# Altium schematic sheet BSPD.SchDoc
size 528 x 268 mm; Origin: Eagle
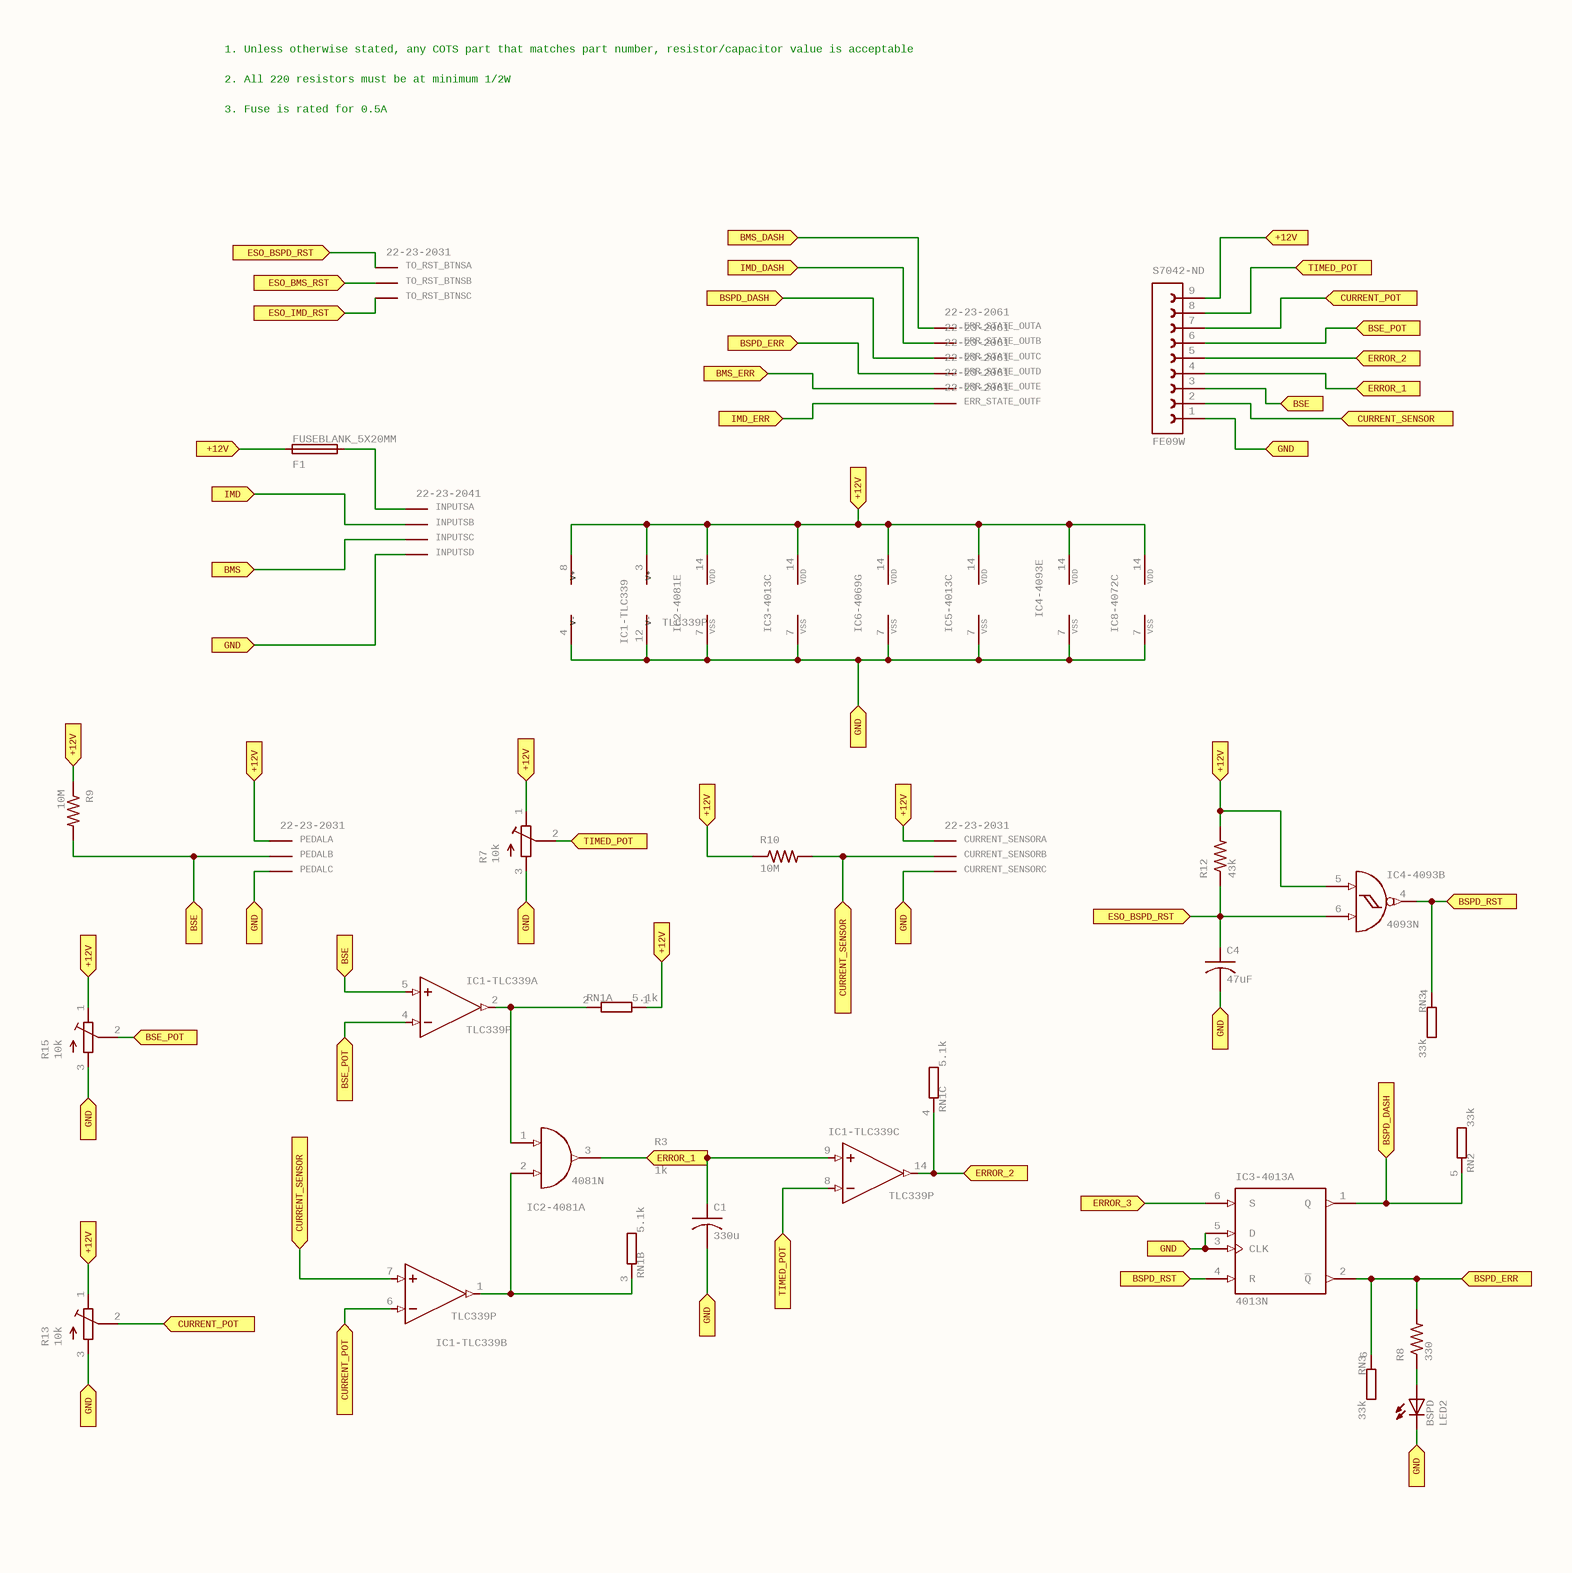
[diagram p0: BSPD.SchDoc, left]
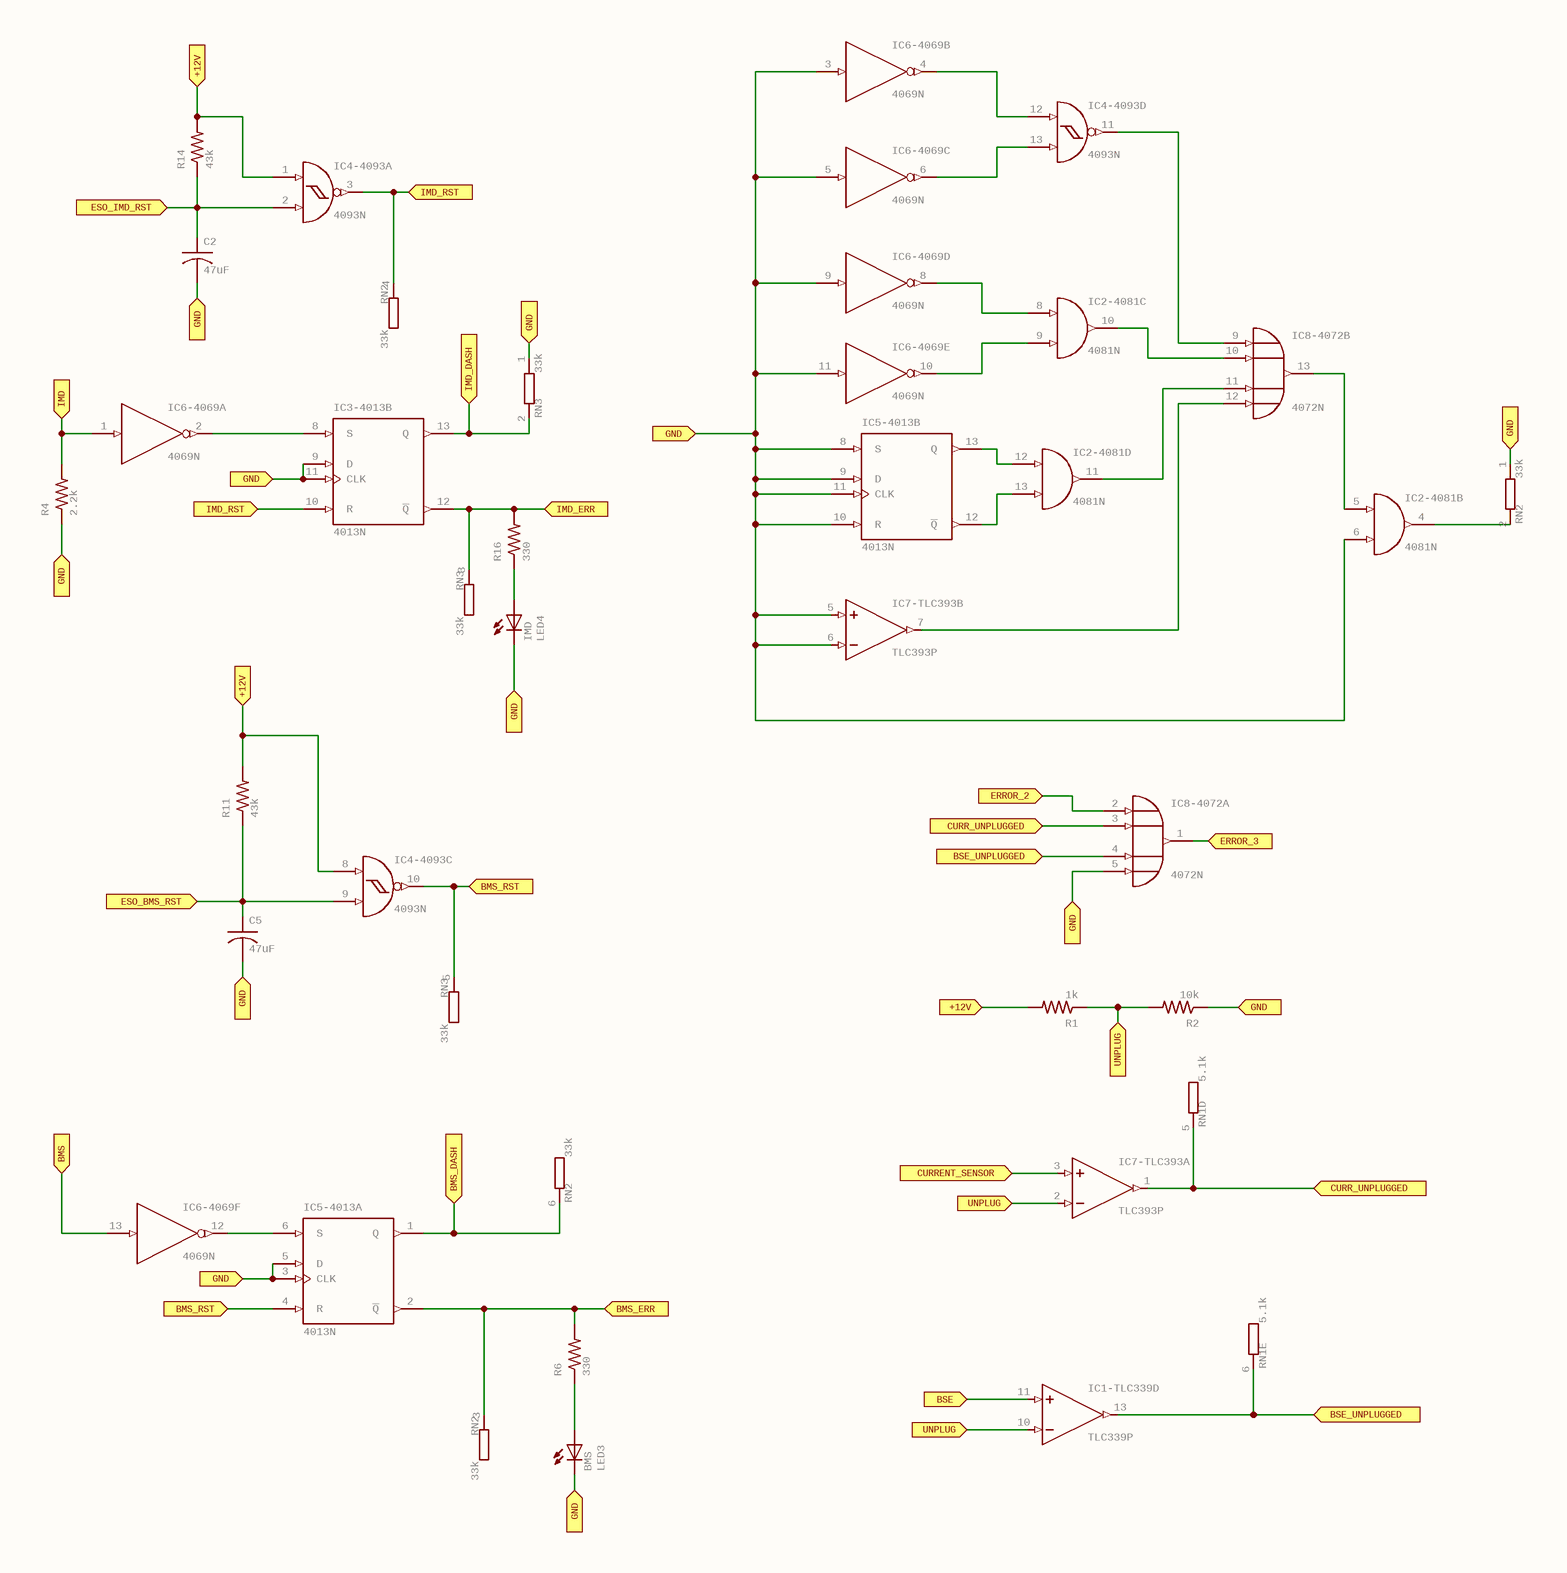
[diagram p1: BSPD.SchDoc, right]

## Parts
BMS  LED3  [LED3MM]
BSPD  LED2  [LED3MM]
C1  330u  [C225-108X268]
C2  47uF  [C050-024X044]
C4  47uF  [C050-024X044]
C5  47uF  [C050-024X044]
CURRENT_SENSOR  22-23-2031  [22-23-2031]  (parts A,B,C of 3)
ERR_STATE_OUT  22-23-2061  [22-23-2061]  (parts A,B,C,D,E,F of 6)
F1  FUSEBLANK_5X20MM  [FUSE_HOLDER_5X20MM]
IC1-TLC339  TLC339P  [DIL14]  (parts A,B,C,D,E of 5)
IC2-4081  4081N  [DIL14]  (parts A,B,C,D,E of 5)
IC3-4013  4013N  [DIL14]  (parts A,B,C of 3)
IC4-4093  4093N  [DIL14]  (parts A,B,C,D,E of 5)
IC5-4013  4013N  [DIL14]  (parts A,B,C of 3)
IC6-4069  4069N  [DIL14]  (parts A,B,C,D,E,F,G of 7)
IC7-TLC393  TLC393P  [DIL08]  (parts A,B,C of 3)
IC8-4072  4072N  [DIL14]  (parts A,B,C of 3)
IMD  LED4  [LED3MM]
INPUTS  22-23-2041  [22-23-2041]  (parts A,B,C,D of 4)
PEDAL  22-23-2031  [22-23-2031]  (parts A,B,C of 3)
R1  1k  [0207/12]
R2  10k  [0207/12]
R3  1k  [0207/12]
R4  2.2k  [0207/12]
R6  330  [0207/12]
R7  10k  [RTRIM3006P]
R8  330  [0207/12]
R9  10M  [0207/12]
R10  10M  [0207/12]
R11  43k  [0207/12]
R12  43k  [0207/12]
R13  10k  [RTRIM3006P]
R14  43k  [0207/12]
R15  10k  [RTRIM3006P]
R16  330  [0207/12]
RN1  5.1k  [SIL6]  (parts A,B,C,D,E of 5)
RN2  33k  PART: RN2  [SIL6]  (parts A,B,C,D,E of 5)
RN3  33k  PART: RN3  [SIL6]  (parts A,B,C,D,E of 5)
S7042-ND  FE09W  [FE09W]
TO_RST_BTNS  22-23-2031  [22-23-2031]  (parts A,B,C of 3)

## Ports
+12V (in), BMS (in), BMS_DASH (in), BMS_ERR (in), BMS_RST (in), BSE (in), BSE_POT (in), BSE_UNPLUGGED (in), BSPD_DASH (in), BSPD_ERR (in), BSPD_RST (in), CURR_UNPLUGGED (in), CURRENT_POT (in), CURRENT_SENSOR (in), ERROR_1 (in), ERROR_2 (in), ERROR_3 (in), ESO_BMS_RST (in), ESO_BSPD_RST (in), ESO_IMD_RST (in), GND (in), IMD (in), IMD_DASH (in), IMD_ERR (in), IMD_RST (in), TIMED_POT (in), UNPLUG (in)

## Nets
+12V: CURRENT_SENSOR.1(S) F1.1 IC1-TLC339.3(V+) IC2-4081.14(VDD) IC3-4013.14(VDD) IC4-4093.1(I0) IC4-4093.5(I0) IC4-4093.8(I0) IC4-4093.14(VDD) IC5-4013.14(VDD) IC6-4069.14(VDD) IC7-TLC393.8(V+) IC8-4072.14(VDD) PEDAL.1(S) R1.2 R7.1(E) R9.1 R10.1 R11.2 R12.2 R13.1(E) R14.2 R15.1(E) RN1.1 S7042-ND.9 ; port +12V
BMS: IC6-4069.13(I) INPUTS.3(S) ; port BMS
BMS_DASH: ERR_STATE_OUT.1(S) IC5-4013.1(Q) RN2.6 ; port BMS_DASH
BMS_ERR: ERR_STATE_OUT.5(S) IC5-4013.2(~{Q}) R6.2 RN2.3 ; port BMS_ERR
BMS_RST: IC4-4093.10(O) IC5-4013.4(R) RN3.5 ; port BMS_RST
BSE: IC1-TLC339.5(+IN) IC1-TLC339.11(+IN) PEDAL.2(S) R9.2 S7042-ND.3 ; port BSE
BSE_POT: IC1-TLC339.4(-IN) R15.2(S) S7042-ND.6 ; port BSE_POT
BSE_UNPLUGGED: IC1-TLC339.13(OUT) IC8-4072.4(I2) RN1.6 ; port BSE_UNPLUGGED
BSPD_DASH: ERR_STATE_OUT.3(S) IC3-4013.1(Q) RN2.5 ; port BSPD_DASH
BSPD_ERR: ERR_STATE_OUT.4(S) IC3-4013.2(~{Q}) R8.2 RN3.6 ; port BSPD_ERR
BSPD_RST: IC3-4013.4(R) IC4-4093.4(O) RN3.4 ; port BSPD_RST
CURR_UNPLUGGED: IC7-TLC393.1(OUT) IC8-4072.3(I1) RN1.5 ; port CURR_UNPLUGGED
CURRENT_POT: IC1-TLC339.6(-IN) R13.2(S) S7042-ND.7 ; port CURRENT_POT
CURRENT_SENSOR: CURRENT_SENSOR.2(S) IC1-TLC339.7(+IN) IC7-TLC393.3(+IN) R10.2 S7042-ND.2 ; port CURRENT_SENSOR
ERROR_1: C1.1 IC1-TLC339.9(+IN) IC2-4081.3(O) R3.1 R3.2 S7042-ND.4 ; port ERROR_1
ERROR_2: IC1-TLC339.14(OUT) IC8-4072.2(I0) RN1.4 S7042-ND.5 ; port ERROR_2
ERROR_3: IC3-4013.6(S) IC8-4072.1(O) ; port ERROR_3
ESO_BMS_RST: C5.1 IC4-4093.9(I1) R11.1 TO_RST_BTNS.2(S) ; port ESO_BMS_RST
ESO_BSPD_RST: C4.1 IC4-4093.6(I1) R12.1 TO_RST_BTNS.1(S) ; port ESO_BSPD_RST
ESO_IMD_RST: C2.1 IC4-4093.2(I1) R14.1 TO_RST_BTNS.3(S) ; port ESO_IMD_RST
GND: BMS.K(C) BSPD.K(C) C1.2 C2.2 C4.2 C5.2 CURRENT_SENSOR.3(S) IC1-TLC339.12(V-) IC2-4081.6(I1) IC2-4081.7(VSS) IC3-4013.3(CLK) IC3-4013.5(D) IC3-4013.7(VSS) IC3-4013.9(D) IC3-4013.11(CLK) IC4-4093.7(VSS) IC5-4013.3(CLK) IC5-4013.5(D) IC5-4013.7(VSS) IC5-4013.8(S) IC5-4013.9(D) IC5-4013.10(R) IC5-4013.11(CLK) IC6-4069.3(I) IC6-4069.5(I) IC6-4069.7(VSS) IC6-4069.9(I) IC6-4069.11(I) IC7-TLC393.4(V-) IC7-TLC393.5(+IN) IC7-TLC393.6(-IN) IC8-4072.5(I3) IC8-4072.7(VSS) IMD.K(C) INPUTS.4(S) PEDAL.3(S) R2.1 R4.1 R7.3(A) R13.3(A) R15.3(A) RN2.1 RN3.1 S7042-ND.1 ; port GND
IMD: IC6-4069.1(I) INPUTS.2(S) R4.2 ; port IMD
IMD_DASH: ERR_STATE_OUT.2(S) IC3-4013.13(Q) RN3.2 ; port IMD_DASH
IMD_ERR: ERR_STATE_OUT.6(S) IC3-4013.12(~{Q}) R16.2 RN3.3 ; port IMD_ERR
IMD_RST: IC3-4013.10(R) IC4-4093.3(O) RN2.4 ; port IMD_RST
TIMED_POT: IC1-TLC339.8(-IN) R7.2(S) S7042-ND.8 ; port TIMED_POT
UNPLUG: IC1-TLC339.10(-IN) IC7-TLC393.2(-IN) R1.1 R2.2 ; port UNPLUG
NetBMS_A: BMS.A R6.1
NetBSPD_A: BSPD.A R8.1
NetF1_2: F1.2 INPUTS.1(S)
NetIC1-TLC339_1: IC1-TLC339.1(OUT) IC2-4081.2(I1) RN1.3
NetIC1-TLC339_2: IC1-TLC339.2(OUT) IC2-4081.1(I0) RN1.2
NetIC2-4081_4: IC2-4081.4(O) RN2.2
NetIC2-4081_5: IC2-4081.5(I0) IC8-4072.13(O)
NetIC2-4081_8: IC2-4081.8(I0) IC6-4069.8(O)
NetIC2-4081_9: IC2-4081.9(I1) IC6-4069.10(O)
NetIC2-4081_10: IC2-4081.10(O) IC8-4072.10(I1)
NetIC2-4081_11: IC2-4081.11(O) IC8-4072.11(I2)
NetIC2-4081_12: IC2-4081.12(I0) IC5-4013.13(Q)
NetIC2-4081_13: IC2-4081.13(I1) IC5-4013.12(~{Q})
NetIC3-4013_8: IC3-4013.8(S) IC6-4069.2(O)
NetIC4-4093_11: IC4-4093.11(O) IC8-4072.9(I0)
NetIC4-4093_12: IC4-4093.12(I0) IC6-4069.4(O)
NetIC4-4093_13: IC4-4093.13(I1) IC6-4069.6(O)
NetIC5-4013_6: IC5-4013.6(S) IC6-4069.12(O)
NetIC7-TLC393_7: IC7-TLC393.7(OUT) IC8-4072.12(I3)
NetIMD_A: IMD.A R16.1

## Notes on the sheet
- 1. Unless otherwise stated, any COTS part that matches part number, resistor/capacitor value is acceptable
- 2. All 220 resistors must be at minimum 1/2W
- 3. Fuse is rated for 0.5A
- (near IC1-TLC339) IC1-TLC339

## Library data of the parts
BMS BSPD IMD = LED3MM: LED   OSRAM: - CHIPLED LG R971, LG N971, LY N971, LG Q971, LY Q971, LO R971, LY R971 LH N974, LH R974 LS Q976, LO Q976, LY Q976 LO Q996 - Hyper CHIPLED LW Q18S LB Q993, LB Q99A, LB R99A - SideLED LS A670, LO A670, LY A670, LG A670, LP A670 LB A673, LV A673, LT A673, LW A673 LH A674 LY A675 LS A676, LA A676, LO A676, LY A676, LW A676 LS A679, LY A679, LG A679 -  Hyper Micro SIDELEDÂ® LS Y876, LA Y876, LO Y876, LY Y876 LT Y87S - SmartLED LW L88C, LW L88S LB L89C, LB L89S, LG L890 LS L89K, LO L89K, LY L89K LS L896, LA L896, LO L896, LY L896 - TOPLED LS T670, LO T670, LY T670, LG T670, LP T670 LSG T670, LSP T670, LSY T670, LOP T670, LYG T670 LG T671, LOG T671, LSG T671 LB T673, LV T673, LT T673, LW T673 LH T674 LS T676, LA T676, LO T676, LY T676, LB T676, LH T676, LSB T676, LW T676 LB T67C, LV T67C, LT T67C, LS T67K, LO T67K, LY T67K, LW E67C LS E67B, LA E67B, LO E67B, LY E67B, LB E67C, LV E67C, LT E67C LW T67C LS T679, LY T679, LG T679 LS T770, LO T770, LY T770, LG T770, LP T770 LB T773, LV T773, LT T773, LW T773 LH T774 LS E675, LA E675, LY E675, LS T675 LS T776, LA T776, LO T776, LY T776, LB T776 LHGB T686 LT T68C, LB T68C - Hyper Mini TOPLEDÂ® LB M676 - Mini TOPLED SantanaÂ® LG M470 LS M47K, LO M47K, LY M47K    Source: http://www.osram.convergy.de   LUXEON: - LUMILEDÂ® LXK2-PW12-R00, LXK2-PW12-S00, LXK2-PW14-U00, LXK2-PW14-V00 LXK2-PM12-R00, LXK2-PM12-S00, LXK2-PM14-U00 LXK2-PE12-Q00, LXK2-PE12-R00, LXK2-PE12-S00, LXK2-PE14-T00, LXK2-PE14-U00 LXK2-PB12-K00, LXK2-PB12-L00, LXK2-PB12-M00, LXK2-PB14-N00, LXK2-PB14-P00, LXK2-PB14-Q00 LXK2-PR12-L00, LXK2-PR12-M00, LXK2-PR14-Q00, LXK2-PR14-R00 LXK2-PD12-Q00, LXK2-PD12-R00, LXK2-PD12-S00 LXK2-PH12-R00, LXK2-PH12-S00 LXK2-PL12-P00, LXK2-PL12-Q00, LXK2-PL12-R00    Source: www.luxeon.com   KINGBRIGHT:   KA-3528ASYC Source: www.kingbright.com; GateName_1: G$1; DeviceName: 3MM; SymbolName_1: LED; LibraryName: led; DeviceSetName: LED
C1 = C-US225-108X268: CAPACITOR, American symbol; GateName_1: G$1; SymbolName_1: C-US; DeviceName: 225-108X268; LibraryName: rcl; DeviceSetName: C-US; SPICEPREFIX: C
C2 C4 C5 = C-US050-024X044: CAPACITOR, American symbol; GateName_1: G$1; SymbolName_1: C-US; DeviceName: 050-024X044; LibraryName: rcl; DeviceSetName: C-US; SPICEPREFIX: C
CURRENT_SENSOR PEDAL TO_RST_BTNS = 22-23-2031: .100" (2.54mm) Center Header - 3 Pin; GateName_1: -1; SymbolName_1: MV; GateName_2: -2; SymbolName_2: M; GateName_3: -3; MF: MOLEX; SymbolName_3: M; LibraryName: con-molex; DeviceSetName: 22-23-2031; MPN: 22-23-2031; OC_FARNELL: 1462950; OC_NEWARK: 30C0862
ERR_STATE_OUT = 22-23-2061: .100" (2.54mm) Center Header - 6 Pin; GateName_1: -1; SymbolName_1: MV; GateName_2: -2; SymbolName_2: M; GateName_3: -3; GateName_4: -4; GateName_5: -5; GateName_6: -6; MF: MOLEX; SymbolName_3: M; SymbolName_4: M; SymbolName_5: M; SymbolName_6: M; LibraryName: con-molex; DeviceSetName: 22-23-2061; MPN: 22-23-2061; OC_FARNELL: 1462922; OC_NEWARK: 27C1933
F1 = FUSEBLANK_5X20MM: Fuse; GateName_1: G$1; SymbolName_1: FUSE; DeviceName: BLANK_5X20MM; LibraryName: fuse; DeviceSetName: FUSE; MF: MF; MPN: MPN; OC_FARNELL: unknown; OC_NEWARK: unknown
IC1-TLC339 = TLC339P: COMPARATOR; GateName_1: A; SymbolName_1: OPAMP; GateName_2: B; GateName_3: C; GateName_4: D; GateName_5: P; SymbolName_5: PWR+-; DeviceSetName: TLC339; SymbolName_2: OPAMP; SymbolName_3: OPAMP; SymbolName_4: OPAMP; DeviceName: P; LibraryName: linear
IC2-4081 = 4081N: Quad 2-input AND; GateName_1: A; SymbolName_1: 4081; GateName_2: B; GateName_3: C; GateName_4: D; GateName_5: P; SymbolName_5: PWRN; DeviceName: N; SymbolName_2: 4081; SymbolName_3: 4081; SymbolName_4: 4081; LibraryName: 40xx; DeviceSetName: 4081
IC3-4013 IC5-4013 = 4013N: Dual D FLIP FLOP, set/reset; GateName_1: A; SymbolName_1: 4013; GateName_2: B; GateName_3: P; SymbolName_3: PWRN; DeviceName: N; SymbolName_2: 4013; LibraryName: 40xx; DeviceSetName: 4013
IC4-4093 = 4093N: Quad 2-input NAND schmitt trigger; GateName_1: A; SymbolName_1: 4093; GateName_2: B; GateName_3: C; GateName_4: D; GateName_5: P; SymbolName_5: PWRN; DeviceName: N; SymbolName_2: 4093; SymbolName_3: 4093; SymbolName_4: 4093; LibraryName: 40xx; DeviceSetName: 4093
IC6-4069 = 4069N: Hex INVERTER; GateName_1: A; SymbolName_1: 4069; GateName_2: B; GateName_3: C; GateName_4: D; GateName_5: E; GateName_6: F; GateName_7: P; SymbolName_7: PWRN; DeviceName: N; SymbolName_2: 4069; SymbolName_3: 4069; SymbolName_4: 4069; SymbolName_5: 4069; SymbolName_6: 4069; LibraryName: 40xx; DeviceSetName: 4069
IC7-TLC393 = TLC393P: COMPARATOR; GateName_1: A; SymbolName_1: OPAMP; GateName_2: B; GateName_3: P; SymbolName_3: PWR+-; DeviceSetName: TLC393; SymbolName_2: OPAMP; DeviceName: P; LibraryName: linear
IC8-4072 = 4072N: Dual 4-input OR; GateName_1: A; SymbolName_1: 4072; GateName_2: B; GateName_3: P; SymbolName_3: PWRN; DeviceName: N; SymbolName_2: 4072; LibraryName: 40xx; DeviceSetName: 4072
INPUTS = 22-23-2041: .100" (2.54mm) Center Header - 4 Pin; GateName_1: -1; SymbolName_1: MV; GateName_2: -2; SymbolName_2: M; GateName_3: -3; GateName_4: -4; MF: MOLEX; SymbolName_3: M; SymbolName_4: M; LibraryName: con-molex; DeviceSetName: 22-23-2041; MPN: 22-23-2041; OC_FARNELL: 1462920; OC_NEWARK: 38C0355
R1-R4 R6 R8-R12 R14 R16 = R-US_0207/12: RESISTOR, American symbol; GateName_1: G$1; SymbolName_1: R-US; DeviceSetName: R-US_; DeviceName: 0207/12; LibraryName: rcl; SPICEPREFIX: R
R7 R13 R15 = R-TRIMM3006P: Trimm resistor; GateName_1: G$1; SymbolName_1: R-TRIM; DeviceName: 3006P; LibraryName: rcl; DeviceSetName: R-TRIMM; SPICEMODEL: X; SPICEPREFIXL: POT
RN1 = GE05R: SIL RESISTOR; GateName_1: A; SymbolName_1: R-NV; GateName_2: B; SymbolName_2: R-NV1; GateName_3: C; GateName_4: D; GateName_5: E; SymbolName_3: R-NV1; SymbolName_4: R-NV1; SymbolName_5: R-NV1; LibraryName: resistor-sil; DeviceSetName: GE05R; MF: MF; MPN: MPN; OC_FARNELL: unknown; OC_NEWARK: unknown
RN2 RN3 = GE05RP: SIL RESISTOR; GateName_1: A; SymbolName_1: R-PV; GateName_2: B; SymbolName_2: R-PV1; GateName_3: C; GateName_4: D; GateName_5: E; SymbolName_3: R-PV1; SymbolName_4: R-PV1; SymbolName_5: R-PV1; LibraryName: resistor-sil; DeviceSetName: GE05RP; MF: MF; MPN: MPN; OC_FARNELL: unknown; OC_NEWARK: unknown
S7042-ND = FE09W: FEMALE HEADER; GateName_1: G$1; SymbolName_1: FE09-1; LibraryName: con-lsta; DeviceSetName: FE09W; MF: MF; MPN: MPN; OC_FARNELL: unknown; OC_NEWARK: unknown